# Altium schematic sheet SH7 - MICROCONTROLLER.SchDoc: Microcontroller
size B; CheckedBy: Cindy Li; Engineer: Farris Matar; Organization: UW Robotics; Address1: 200 University Avenue; Address2: Waterloo; Address3: Ontario; Address4: Canada N2L 3G6; DocumentNumber: 7; Revision: 3; SheetNumber: 7; SheetTotal: 9
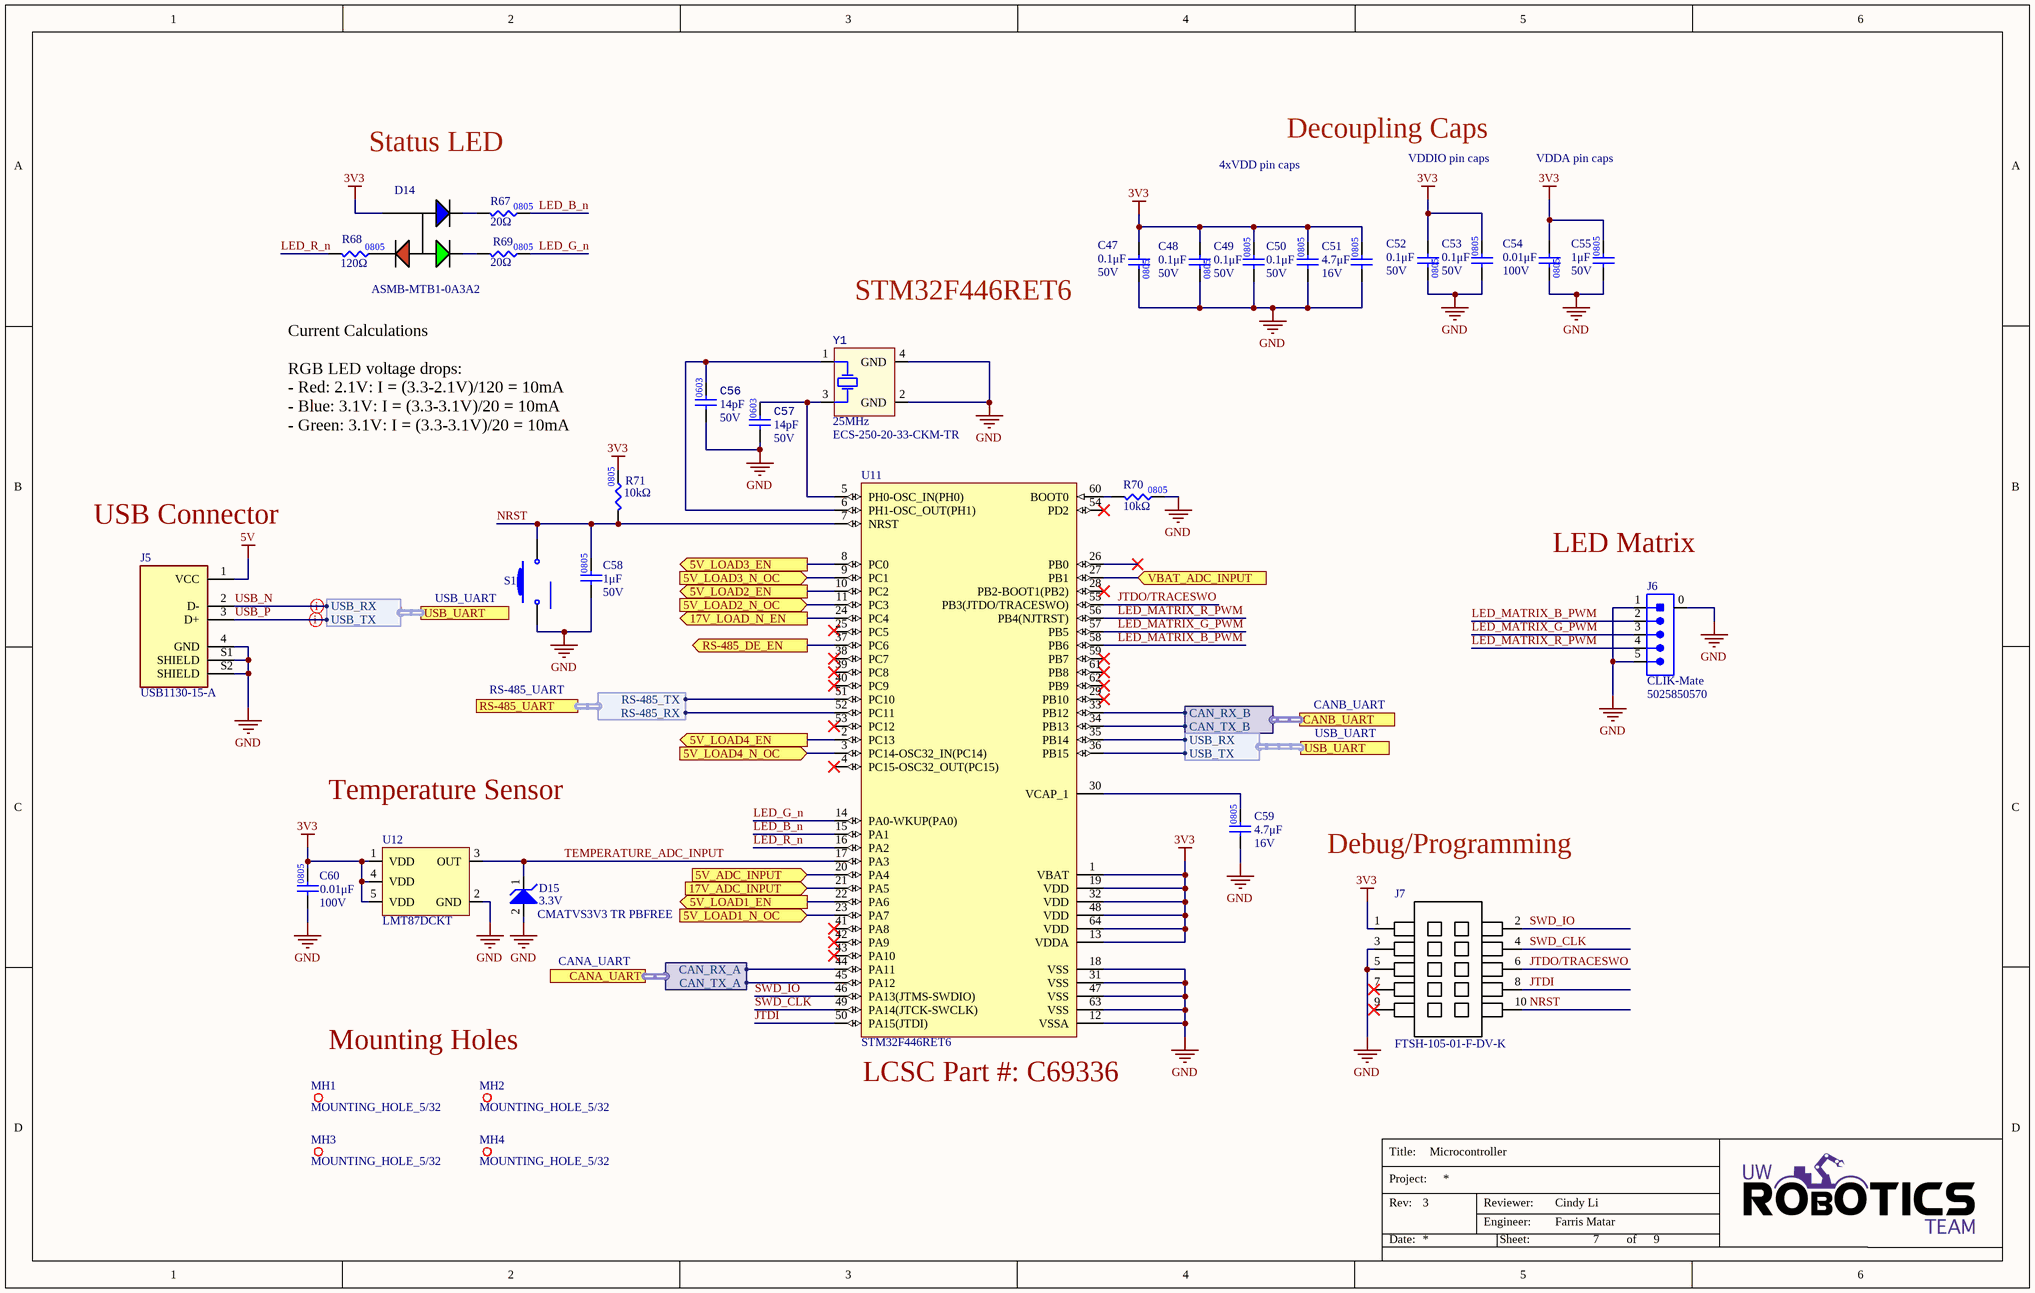
[diagram p0: SH7 - MICROCONTROLLER.SchDoc]

## Parts
C47  value 0.1μF  Voltage Rating: 50V  [CAP2012]  (hidden comment: CAP_0.1uF_50V_0805)
C48  value 0.1μF  Voltage Rating: 50V  [CAP2012]  (hidden comment: CAP_0.1uF_50V_0805)
C49  value 0.1μF  Voltage Rating: 50V  [CAP2012]  (hidden comment: CAP_0.1uF_50V_0805)
C50  value 0.1μF  Voltage Rating: 50V  [CAP2012]  (hidden comment: CAP_0.1uF_50V_0805)
C51  value 4.7μF  Voltage Rating: 16V  [CAP0805]  (hidden comment: CAP_4.7uF_16V_0805)
C52  value 0.1μF  Voltage Rating: 50V  [CAP2012]  (hidden comment: CAP_0.1uF_50V_0805)
C53  value 0.1μF  Voltage Rating: 50V  [CAP2012]  (hidden comment: CAP_0.1uF_50V_0805)
C54  value 0.01μF  Voltage Rating: 100V  [CAP0805]  (hidden comment: CAP_0.01uF_100V_0805)
C55  value 1μF  Voltage Rating: 50V  [CAP2012]  (hidden comment: CAP_1uF_50V_0805)
C56  value 14pF  Voltage Rating: 50V  [CAP0603]  (hidden comment: CAP_14pF_50V_0603)
C57  value 14pF  Voltage Rating: 50V  [CAP0603]  (hidden comment: CAP_14pF_50V_0603)
C58  value 1μF  Voltage Rating: 50V  [CAP2012]  (hidden comment: CAP_1uF_50V_0805)
C59  value 4.7μF  Voltage Rating: 16V  [CAP0805]  (hidden comment: CAP_4.7uF_16V_0805)
C60  value 0.01μF  Voltage Rating: 100V  [CAP0805]  (hidden comment: CAP_0.01uF_100V_0805)
D14  Manufacturer Part Number 1: ASMB-MTB1-0A3A2  [LED_RGB]  (hidden comment: LED_RGB)
D15  Manufacturer Part Number 1: CMATVS3V3 TR PBFREE  Voltage - Reverse Standoff (Typ): 3.3V  [SOD-923]  (hidden comment: TVS_DIODE_UNIDIR_3.3V_7A)
J5  Manufacturer Part Number 1: USB1130-15-A  [USB-A 2.0 Connector]  (hidden comment: USB-A 2.0 Connector)
J6  Family: CLIK-Mate  Manufacturer Part Number 1: 5025850570  [MOLEX-5025850570]  (hidden comment: CON_5M_SM_RA)
J7  Manufacturer Part Number 1: FTSH-105-01-F-DV-K  [FTSH-105-01-F-DV-K-P-TR]  (hidden comment: CON_PROGRAMMING)
MH1  MOUNTING_HOLE_5/32  [MOUNTING_HOLE_5/38]  (no BOM)
MH2  MOUNTING_HOLE_5/32  [MOUNTING_HOLE_5/38]  (no BOM)
MH3  MOUNTING_HOLE_5/32  [MOUNTING_HOLE_5/38]  (no BOM)
MH4  MOUNTING_HOLE_5/32  [MOUNTING_HOLE_5/38]  (no BOM)
R67  value 20Ω  [RES0805]  (hidden comment: RES_20Ω_0805_1%)
R68  value 120Ω  [RES0805]  (hidden comment: RES_120Ω_0805_1%)
R69  value 20Ω  [RES0805]  (hidden comment: RES_20Ω_0805_1%)
R70  value 10kΩ  [RES0805]  (hidden comment: RES_10kΩ_0805_5%)
R71  value 10kΩ  [RES0805]  (hidden comment: RES_10kΩ_0805_5%)
S1  SW_PUSHBUTTON  [TACTILE_SWITCH_SMD]  (value not drawn)
U11  STM32F446RET6  [STM-LQFP64_L]
U12  Manufacturer Part Number 1: LMT87DCKT  [SOT65P210X110-5N]  (hidden comment: IC_TEMP_SENSOR_2)
Y1  Frequency: 25MHz  Manufacturer Part Number 1: ECS-250-20-33-CKM-TR  [XTAL_ECS-250-20-33-CKM-TR]  (hidden comment: CRYSTAL_25MHZ_20PF)

## Ports
5V_ADC_INPUT (in), 5V_LOAD1_EN (out), 5V_LOAD1_N_OC (in), 5V_LOAD2_EN (out), 5V_LOAD2_N_OC (in), 5V_LOAD3_EN (out), 5V_LOAD3_N_OC (in), 5V_LOAD4_EN (out), 5V_LOAD4_N_OC (in), 17V_ADC_INPUT (in), 17V_LOAD_N_EN (out), CANA_UART (harness CANA_UART), CANB_UART (harness CANB_UART), RS-485_DE_EN (out), RS-485_UART (harness RS-485_UART), USB_UART (harness USB_UART), VBAT_ADC_INPUT (in)

## Harnesses
CANA_UART: CAN_RX_A, CAN_TX_A
CANB_UART: CAN_RX_B, CAN_TX_B
RS-485_UART: RS-485_TX, RS-485_RX
USB_UART: USB_TX, USB_RX

## Nets
3V3: C47.2 C48.2 C49.2 C50.2 C51.2 C52.2 C53.2 C54.2 C55.2 C60.2 D14.4(COMMON_ANODE) J7.1 R71.2 U11.1(VBAT) U11.13(VDDA) U11.19(VDD) U11.32(VDD) U11.48(VDD) U11.64(VDD) U12.1(VDD) U12.4(VDD) U12.5(VDD)
5V: J5.1(VCC)
GND: C47.1 C48.1 C49.1 C50.1 C51.1 C52.1 C53.1 C54.1 C55.1 C56.1 C57.1 C58.1 C59.1 C60.1 D15.2 J5.4(GND) J5.S1(SHIELD) J5.S2(SHIELD) J6.0 J6.1 J6.5 J7.3 J7.5 R70.2 S1.1 U11.12(VSSA) U11.18(VSS) U11.31(VSS) U11.47(VSS) U11.63(VSS) U12.2(GND) Y1.2(GND) Y1.4(GND)
5V_ADC_INPUT: U11.20(PA4) ; port 5V_ADC_INPUT
5V_LOAD1_EN: U11.22(PA6) ; port 5V_LOAD1_EN
5V_LOAD1_N_OC: U11.23(PA7) ; port 5V_LOAD1_N_OC
5V_LOAD2_EN: U11.10(PC2) ; port 5V_LOAD2_EN
5V_LOAD2_N_OC: U11.11(PC3) ; port 5V_LOAD2_N_OC
5V_LOAD3_EN: U11.8(PC0) ; port 5V_LOAD3_EN
5V_LOAD3_N_OC: U11.9(PC1) ; port 5V_LOAD3_N_OC
5V_LOAD4_EN: U11.2(PC13) ; port 5V_LOAD4_EN
5V_LOAD4_N_OC: U11.3(PC14-OSC32_IN(PC14)) ; port 5V_LOAD4_N_OC
17V_ADC_INPUT: U11.21(PA5) ; port 17V_ADC_INPUT
17V_LOAD_N_EN: U11.24(PC4) ; port 17V_LOAD_N_EN
JTDI: J7.8 U11.50(PA15(JTDI))
JTDO/TRACESWO: J7.6 U11.55(PB3(JTDO/TRACESWO))
LED_B_n: R67.2 U11.15(PA1)
LED_G_n: R69.2 U11.14(PA0-WKUP(PA0))
LED_MATRIX_B_PWM: J6.2 U11.58(PB6)
LED_MATRIX_G_PWM: J6.3 U11.57(PB5)
LED_MATRIX_R_PWM: J6.4 U11.56(PB4(NJTRST))
LED_R_n: R68.1 U11.16(PA2)
NRST: C58.2 J7.10 R71.1 S1.2 U11.7(NRST)
RS-485_DE_EN: U11.37(PC6) ; port RS-485_DE_EN
SWD_CLK: J7.4 U11.49(PA14(JTCK-SWCLK))
SWD_IO: J7.2 U11.46(PA13(JTMS-SWDIO))
TEMPERATURE_ADC_INPUT: D15.1 U11.17(PA3) U12.3(OUT)
USB_N: J5.2(D-) U11.35(PB14) ; port USB_UART.USB_RX
USB_P: J5.3(D+) U11.36(PB15) ; port USB_UART.USB_TX
VBAT_ADC_INPUT: U11.27(PB1) ; port VBAT_ADC_INPUT
NetC56_2: C56.2 U11.6(PH1-OSC_OUT(PH1)) Y1.1(HOT)
NetC57_2: C57.2 U11.5(PH0-OSC_IN(PH0)) Y1.3(HOT)
NetC59_2: C59.2 U11.30(VCAP_1)
NetD14_1: D14.1(CATHODE_(RED)) R68.2
NetD14_2: D14.2(CATHODE_(GREEN)) R69.1
NetD14_3: D14.3(CATHODE_(BLUE)) R67.1
NetR70_1: R70.1 U11.60(BOOT0)
NetU11_33: U11.33(PB12) ; port CANB_UART.CAN_RX_B
NetU11_34: U11.34(PB13) ; port CANB_UART.CAN_TX_B
NetU11_44: U11.44(PA11) ; port CANA_UART.CAN_RX_A
NetU11_45: U11.45(PA12) ; port CANA_UART.CAN_TX_A
NetU11_51: U11.51(PC10) ; port RS-485_UART.RS-485_TX
NetU11_52: U11.52(PC11) ; port RS-485_UART.RS-485_RX

Not connected (* = marked no-connect by the designer): J7 7* 9*; U11 4(PC15-OSC32_OUT(PC15))* 25(PC5) 26(PB0)* 28(PB2-BOOT1(PB2))* 29(PB10)* 38(PC7)* 39(PC8)* 40(PC9)* 41(PA8)* 42(PA9)* 43(PA10)* 53(PC12)* 54(PD2)* 59(PB7)* 61(PB8)* 62(PB9)*

## Layout directives
differential pair: USB_N, USB_P

## Notes on the sheet
- Status LED
- 4xVDD pin caps
- Decoupling Caps
- VDDIO pin caps
- VDDA pin caps
- STM32F446RET6
- Current Calculations
  RGB LED voltage drops:
  - Red: 2.1V: I = (3.3-2.1V)/120 = 10mA
  - Blue: 3.1V: I = (3.3-3.1V)/20 = 10mA
  - Green: 3.1V: I = (3.3-3.1V)/20 = 10mA
- (near J5) USB Connector
- (near J6) LED Matrix
- Temperature Sensor
- Debug/Programming
- Mounting Holes
- (near U11) LCSC Part #: C69336
- Title:
- Project:
- Date:
- Rev:
- Reviewer:
- Engineer:
- Sheet:
- of

## Library data of the parts
C47-C50 C52 C53 = CAP_0.1uF_50V_0805: CAP CER 0.1UF 50V X7R 0805; Manufacturer Part Number 1: GCM21BR71H104KA37K; Manufacturer 1: Murata Electronics; Package/Footprint: 0805; Supplier Part Number 1: 490-8049-1-ND; Supplier 1: Digi-Key; Dielectric: X7R; LCSC Part #: C49678; Mounting Type: SMD
C51 C59 = CAP_4.7uF_16V_0805: CAP CER 4.7UF 16V X5R 0805; Manufacturer Part Number 1: CL21A475KOFNNNE; Manufacturer 1: Samsung Electro-Mechanics; Supplier Part Number 1: 1276-1065-1-ND; Supplier 1: Digi-Key; Dielectric: X5R; LCSC Part #: C1779; Mounting Type: SMD; Package: 0805
C54 C60 = CAP_0.01uF_100V_0805: CAP CER 0.01uF 100V X7R 0805; Manufacturer Part Number 1: 08051C103KAT2A; Manufacturer 1: AVX Corporation; Supplier Part Number 1: 478-1358-1-ND; Supplier 1: Digi-Key; Dielectric: X7R; LCSC Part #: C1710; Mounting Type: SMD; Package: 0805
C55 C58 = CAP_1uF_50V_0805: CAP CER 1UF 50V X7R 0805; Manufacturer 1: Samsung Electro-Mechanics; Manufacturer Part Number 1: CL21B105KBFNNNG; Supplier Part Number 1: 1276-6470-1-ND; Supplier 1: Digi-Key; LCSC Part #: C28323; Mounting Type: SMD; Package: 0805
C56 C57 = CAP_14pF_50V_0603: CAP CER 14PF 50V C0G/NP0 0603; Manufacturer 1: Samsung; Manufacturer Part Number 1: CL10C140JB8NNNC; Dielectric: C0G; Supplier 1: Digi-Key; Supplier Part Number 1: 1276-2187-1-ND; Mounting Type: SMD; Package: 0603
D14 = LED_RGB: LED RGB DIFFUSED 4PLCC SMD; Manufacturer 1: Broadcom; Color: Blue,Green,Red; Lens Color: White; Viewing Angle: 115°; Lens Style: Round; Luminous Intensity: 350mcd; Dominant Wavelength: 470nm; Forward Voltage: 3.1V; Test Current: 20mA; Package/Footprint: 4-PLCC; Supplier 1: Digi-Key; Number of Pins: 4; Lens Transparency: Diffused; Supplier Part Number 1: 516-3280-1-ND; Mounting Type: SMD
D15 = TVS_DIODE_UNIDIR_3.3V_7A: TVS DIODE 3.3VWM 11VC SOD923; Manufacturer 1: Central Semiconductor Corp; Voltage - Breakdown (Min): 5V; Voltage - Clamping (Max) @ Ipp: 11V; Supplier 1: Digi-Key; Supplier Part Number 1: 1514-CMATVS3V3TRPBFREECT-ND; Mounting Type: SMD; Package/Footprint: SOD-923
J5 = USB-A 2.0 Connector: USB-A (USB TYPE-A) USB 2.0 Receptacle Connector 4 Position Through Hole, Right Angle; Manufacturer 1: GCT; Supplier 1: Digi-Key; Supplier Part Number 1: 2073-USB1130-15-ACT-ND
J6 = CON_5M_SM_RA: CONN HEADER SMD RIGHT ANGLE 1.5MM PITCH; Manufacturer 1: Molex; Current Rating: 2A; Supplier 1: Digi-Key; Supplier Part Number 1: WM14469CT-ND; Orientation: Right Angle; Mounting Type: SMD; Package/Footprint: SMD
J7 = CON_PROGRAMMING: CONN HEADER SMD 10POS 1.27MM; Manufacturer 1: Samtec; Supplier 1: Digi-Key; Pitch: 1.27mm; Supplier Part Number 1: SAM8796-ND; Mounting Type: SMD
R67 R69 = RES_20Ω_0805_1%: RES 20 OHM 1% 1/8W 0805; Manufacturer 1: Yageo; Manufacturer Part Number 1: RC0805FR-0720RL; Supplier Part Number 1: 311-20.0CRCT-ND; Supplier 1: Digi-Key; LCSC Part #: C17581; Mounting Type: SMD; Package: 0805
R68 = RES_120Ω_0805_1%: RES 120 OHM 1% 1/8W 0805; Manufacturer 1: Vishay; Manufacturer Part Number 1: CRCW0805120RFKEA; Package/Footprint: 0805; Supplier Part Number 1: 541-120CCT-ND; Supplier 1: Digi-Key; LCSC Part #: C17437; Mounting Type: SMD
R70 R71 = RES_10kΩ_0805_5%: RES 10K OHM 5% 1/8W 0805; Manufacturer 1: Panasonic Electronic Components; Manufacturer Part Number 1: ERJ-6GEYJ103V; Package/Footprint: 0805; Supplier Part Number 1: P10KACT-ND; Supplier 1: Digi-Key; LCSC Part #: C17414; Mounting Type: SMD
S1 = SW_PUSHBUTTON: SMT 3.0 X 2.6 MM TACT SWITCH WIT; Manufacturer Part Number 1: 435151014824; Manufacturer 1: Würth Elektronik; Supplier 1: Digi-Key; Supplier Part Number 1: 732-435151014824CT-ND
U11 = MCU_STM32F446RET6: ARM Cortex-M4 32-bit MCU+FPU, 512 KB Flash, 128 KB Internal RAM, 50 I/Os, 64-Pin LQFP, -40 to 85 degC, Tray; I/Os (High Current): 50; Supply Voltage(Vcc) min (V): 1.7; Operating Frequency(F) (Processor speed) (MHz): 180; D/A Converter: 2; Internal RAM Size (kB): 128; FLASH Size (Prog) (kB): 512; Core: ARM Cortex-M4; ComponentLink1Description: Manufacturer URL; Package Reference: 64-Pin Low-profile Quad Flat Package, Body 10 x 10 mm, Pitch 0.5 mm; ComponentLink2URL: http://www.st.com/st-web-ui/static/active/en/resource/technical/document/datasheet/DM00141306.pdf; Packing: Tray; DatasheetVersion: Rev. 6; ComponentLink1URL: http://www.st.com/; ComponentLink2Description: Datasheet; Package Description: LQFP64; Mounting Technology: Surface Mount; Supplier Part Number 1: 497-15376-ND; Supplier 1: Digi-Key
U12 = IC_TEMP_SENSOR_2: SENSOR ANALOG -50C-150C SC70-5; Manufacturer 1: Texas Instruments; Supplier Part Number 1: 296-35730-1-ND; Supplier 1: Digi-Key; Mounting Type: SMD; Package/Footprint: SC70-5
Y1 = CRYSTAL_25MHZ_20PF: CRYSTAL 25.0000MHZ 20PF SMD; Manufacturer 1: ECS Inc.; Load Capacitance: 20pF; Supplier 1: Digi-Key; Supplier Part Number 1: XC1817CT-ND; Mounting Type: SMD; Package/Footprint: SMD